# EAGLE schematic Rev1_0 (EAGLE 6.3)
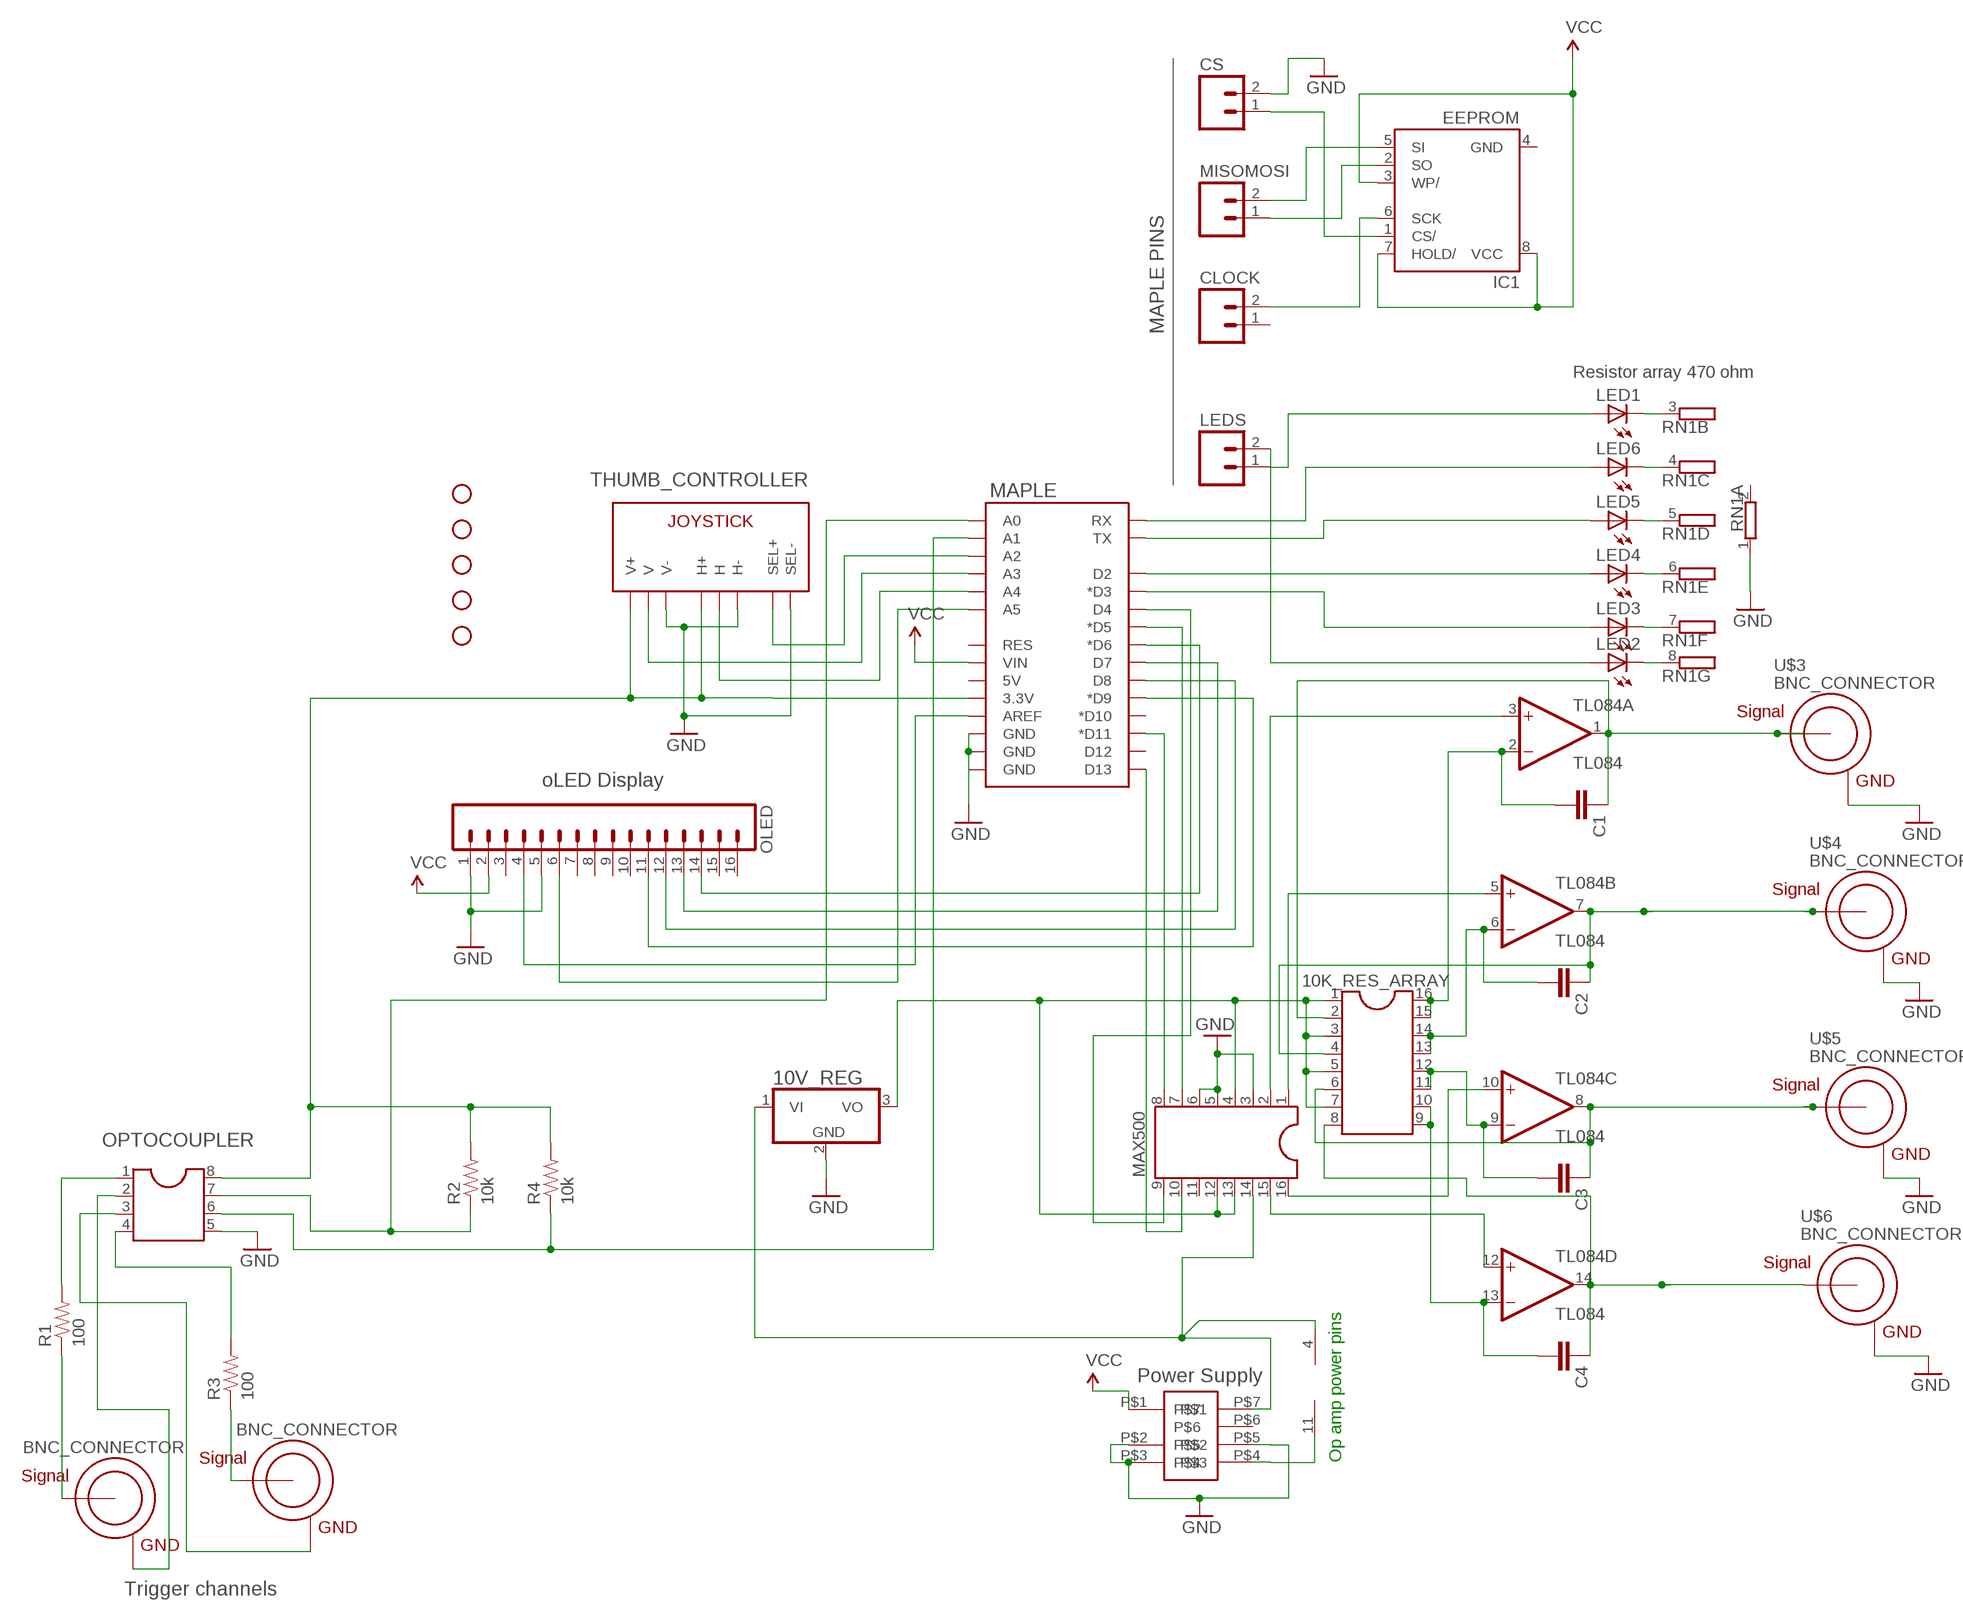
[diagram p0: schematic, sheet 1]

## Parts
10K_RES_ARRAY  DIL16  [DIL16]
10V_REG  7805T  [TO220H]
C1  CAPPTH  [CAP-PTH-SMALL]
C2  CAPPTH  [CAP-PTH-SMALL]
C3  CAPPTH  [CAP-PTH-SMALL]
C4  CAPPTH  [CAP-PTH-SMALL]
CLOCK  M02PTH  [1X02]
CS  M02PTH  [1X02]
IC1  EEPROM  AT25P  [DIL08]
JP2  STAND-OFF  [STAND-OFF]
JP5  STAND-OFF  [STAND-OFF]
JP6  STAND-OFF  [STAND-OFF]
JP8  STAND-OFF  [STAND-OFF]
JP9  STAND-OFF  [STAND-OFF]
LED1  LED3MM  [LED3MM]
LED2  LED3MM  [LED3MM]
LED3  LED3MM  [LED3MM]
LED4  LED3MM  [LED3MM]
LED5  LED3MM  [LED3MM]
LED6  LED3MM  [LED3MM]
LEDS  M02PTH  [1X02]
MAPLE  ARDUINO_SHIELDNOHOLESORLABELS  [DUEMILANOVE_SHIELD_NOHOLES_NOLABELS]
MAX500  DIL16  [DIL16]
MISOMOSI  M02PTH  [1X02]
OLED  M16PTH  [1X16]
OPTOCOUPLER  DIL8  [DIL08]
R1  100  RESISTORAXIAL-0.3  [AXIAL-0.3]
R2  10k  RESISTORAXIAL-0.3  [AXIAL-0.3]
R3  100  RESISTORAXIAL-0.3  [AXIAL-0.3]
R4  10k  RESISTORAXIAL-0.3  [AXIAL-0.3]
RN1  GE07R  [SIL8]
THUMB_CONTROLLER  JOYSTICKPTH  [JOYSTICK]
TL084  TL084  TL084P  [DIL14]
U$1  BNC_CONNECTOR  [BNC_CONNECTOR]
U$2  BNC_CONNECTOR  [BNC_CONNECTOR]
U$3  BNC_CONNECTOR  [BNC_CONNECTOR]
U$4  BNC_CONNECTOR  [BNC_CONNECTOR]
U$5  BNC_CONNECTOR  [BNC_CONNECTOR]
U$6  BNC_CONNECTOR  [BNC_CONNECTOR]
U$8  TDK_LAMBDA_5_TO_BI_12_125MA  [TDK_LAMBDA_5_TO_BI_12_125MA]

## Nets
GND: 10V_REG.2(GND) CS.2 MAPLE.GND@0(GND) MAPLE.GND@1(GND) MAPLE.GND@2(GND) MAX500.3 MAX500.5 MAX500.6 OLED.1 OLED.5 OPTOCOUPLER.5 RN1.1 THUMB_CONTROLLER.B2A(SEL-) THUMB_CONTROLLER.H3(H-) THUMB_CONTROLLER.V3(V-) U$3.GND U$4.GND U$5.GND U$6.GND U$8.P$2 U$8.P$3 U$8.P$5
N$1: LED6.A MAPLE.RX
N$2: LED5.A MAPLE.TX
N$3: LED4.A MAPLE.D2
N$4: LED3.A MAPLE.D3(*D3)
N$5: MAPLE.D11(*D11) MAX500.8
N$6: MAPLE.D13 MAX500.10
N$7: MAPLE.AREF OLED.4
N$8: MAPLE.D4 MAX500.9
N$9: MAPLE.D5(*D5) MAX500.7
N$10: MAPLE.D6(*D6) OLED.14
N$11: MAPLE.D7 OLED.13
N$12: MAPLE.D8 OLED.12
N$13: MAPLE.D9(*D9) OLED.11
N$14: MAPLE.A5 OLED.6
N$15: MAPLE.A4 THUMB_CONTROLLER.H2(H)
N$16: MAPLE.A3 THUMB_CONTROLLER.V2(V)
N$17: MAPLE.A2 THUMB_CONTROLLER.B1A(SEL+)
N$19: R1.P$1 U$1.SIGNAL
N$20: MAPLE.A0 OPTOCOUPLER.7 R2.P$1
N$21: R3.P$1 U$2.SIGNAL
N$22: MAPLE.A1 OPTOCOUPLER.6 R4.P$1
N$23: TL084.11(P:V-) U$8.P$4
N$24: MAX500.2 TL084.3(A:+IN)
N$25: MAX500.1 TL084.5(B:+IN)
N$28: 10V_REG.1(VI) MAX500.14 TL084.4(P:V+) U$8.P$7
N$29: 10K_RES_ARRAY.1 10K_RES_ARRAY.3 10K_RES_ARRAY.5 10K_RES_ARRAY.7 10V_REG.3(VO) MAX500.4 MAX500.12 MAX500.13
N$30: MAX500.16 TL084.10(C:+IN)
N$31: MAX500.15 TL084.12(D:+IN)
N$32: 10K_RES_ARRAY.2 C1.1 TL084.1(A:OUT) U$3.SIGNAL
N$33: 10K_RES_ARRAY.4 C2.1 TL084.7(B:OUT) U$4.SIGNAL
N$34: 10K_RES_ARRAY.6 C3.1 TL084.8(C:OUT) U$5.SIGNAL
N$35: 10K_RES_ARRAY.8 C4.1 TL084.14(D:OUT) U$6.SIGNAL
N$36: LED1.A LEDS.1
N$37: LED2.A LEDS.2
N$38: LED2.K(C) RN1.8
N$39: LED3.K(C) RN1.7
N$40: LED4.K(C) RN1.6
N$41: LED5.K(C) RN1.5
N$42: LED6.K(C) RN1.4
N$43: 10K_RES_ARRAY.15 10K_RES_ARRAY.16 C1.2 TL084.2(A:-IN)
N$44: 10K_RES_ARRAY.13 10K_RES_ARRAY.14 C2.2 TL084.6(B:-IN)
N$45: 10K_RES_ARRAY.11 10K_RES_ARRAY.12 C3.2 TL084.9(C:-IN)
N$46: 10K_RES_ARRAY.9 10K_RES_ARRAY.10 C4.2 TL084.13(D:-IN)
N$47: LED1.K(C) RN1.3
N$52: OPTOCOUPLER.1 R1.P$2
N$53: CS.1 IC1.1(CS/)
N$54: IC1.5(SI) MISOMOSI.2
N$55: IC1.2(SO) MISOMOSI.1
N$56: CLOCK.2 IC1.6(SCK)
N$57: OPTOCOUPLER.2 U$1.GND
N$58: OPTOCOUPLER.4 R3.P$2
N$60: OPTOCOUPLER.3 U$2.GND
N$61: MAPLE.3.3V OPTOCOUPLER.8 R2.P$2 R4.P$2 THUMB_CONTROLLER.H1(H+) THUMB_CONTROLLER.V1(V+)
VCC: IC1.3(WP/) IC1.7(HOLD/) IC1.8(VCC) MAPLE.VIN OLED.2 U$8.P$1
Unconnected: CLOCK.1 MAPLE.5V MAPLE.D10(*D10) MAPLE.D12 MAPLE.RES MAX500.11 OLED.3 OLED.7 OLED.8 OLED.9 OLED.10 OLED.15 OLED.16 RN1.2 U$8.P$6

## Notes on the sheet
- MAPLE PINS
- Resistor array 470 ohm
- oLED Display
- Power Supply
- Op amp power pins
- Trigger channels

## Power pins joined to a net without a drawn wire
GND: IC1.4(GND)

## Library data of the parts
10K_RES_ARRAY MAX500 = ic-package:DIL16: Dual In Line / Socket
10V_REG = linear:78*: Positive VOLTAGE REGULATOR Source: http://cache.national.com/ds/LM/LM78L05.pdf http://www.fairchildsemi.com/ds/LM/LM7805.pdf
C1-C4 = SparkFun:CAP: Capacitor Standard 0603 ceramic capacitor, and 0.1" leaded capacitor.
CLOCK CS LEDS MISOMOSI = SparkFun:M02: Header 2 Standard 2-pin 0.1" header. Use with straight break away headers (SKU : PRT-00116), right angle break away headers (PRT-00553), swiss pins (PRT-00743), machine pins (PRT-00117), and female headers (PRT-00115). Molex polarized connector foot print use with SKU : PRT-08233 with associated crimp pins and housings.
IC1 = atmel:AT25*: SPI bus serial EEPROM
JP2 JP5 JP6 JP8 JP9 = SparkFun:STAND-OFF: Stand Off This is the mechanical footprint for a #4 phillips button head screw. Use the keepout ring to avoid running the screw head into surrounding components. SKU : PRT-00447
LED1-LED6 = SparkFun:LED: LEDs Standard schematic elements and footprints for 5mm, 3mm, 1206, and 0603 sized LEDs. 5mm - Spark Fun Electronics SKU : COM-00529 (and others)
MAPLE = SparkFun:ARDUINO_SHIELD
OLED = SparkFun:M16
OPTOCOUPLER = ic-package:DIL8: Dual In Line / Socket
R1-R4 = SparkFun:RESISTOR: Resistor Basic schematic elements and footprints for 0603, 1206, and PTH resistors.
RN1 = resistor-sil:GE07R: SIL RESISTOR
THUMB_CONTROLLER = SparkFun:JOYSTICK: Thumb Joystick Joystick commonly found in PS2 controllers. Two pots and a select switch. Footprint proven. Spark Fun Electronics SKU : COM-09032
TL084 = linear:TL084: OP AMP
U$1-U$6 = JoshParts:BNC_CONNECTOR
U$8 = JoshParts:TDK_LAMBDA_5_TO_BI_12_125MA

## Net classes
0 default: width 0.203 mm
1 vcc: width 0.254 mm